# Altium schematic sheet DDRmem.SchDoc
size A; SheetNumber: 3; SheetTotal: 5
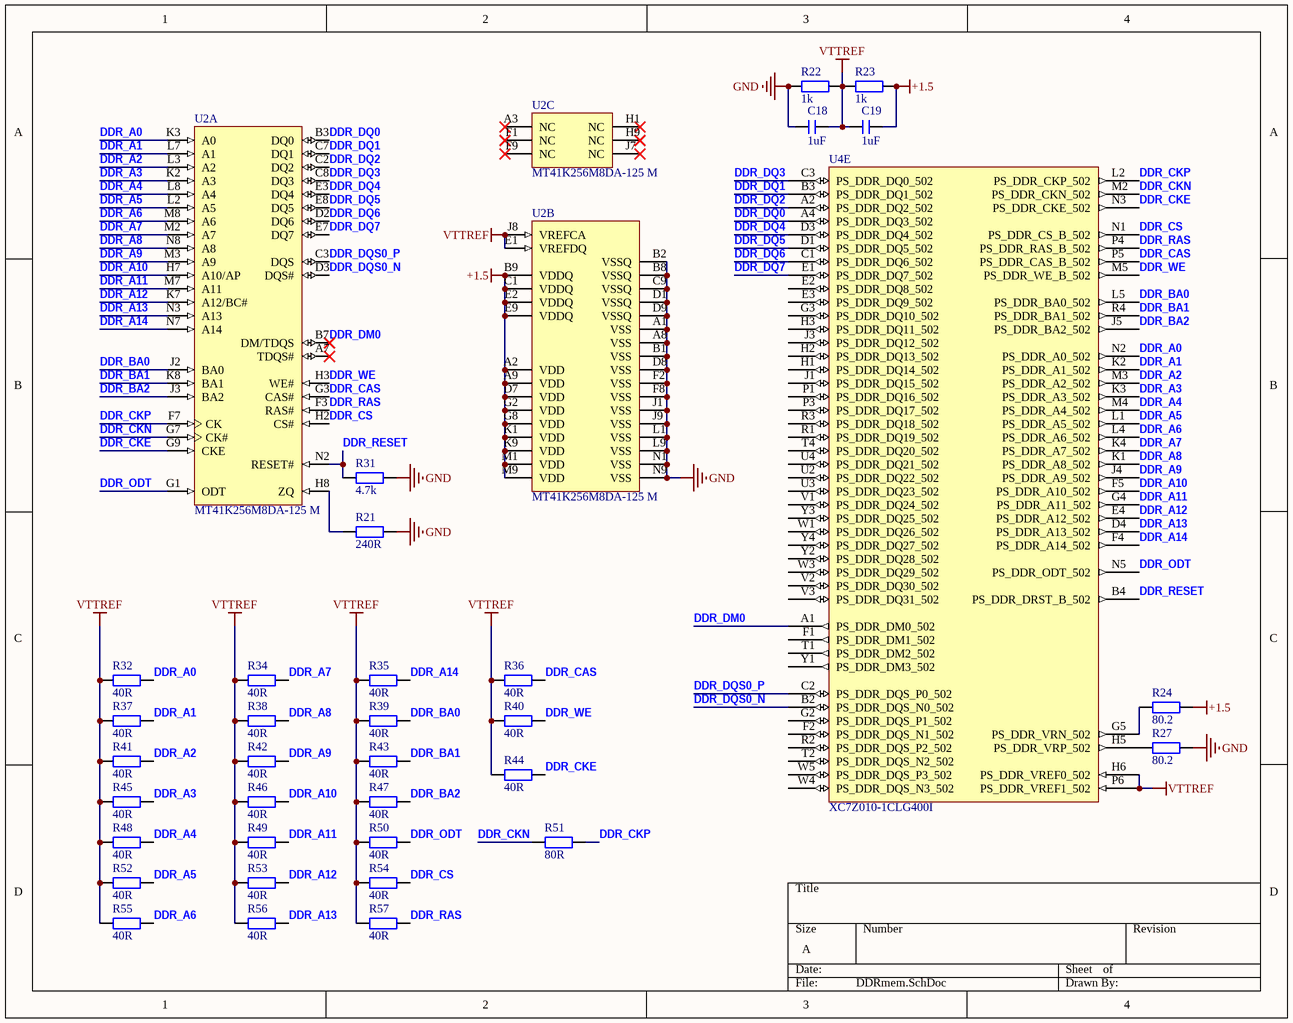
[diagram p0: DDRmem.SchDoc]

## Parts
C18  1uF  [CAP_0201]
C19  1uF  [CAP_0201]
R21  240R  [RES_0201]
R22  1k  [RES_0201]
R23  1k  [RES_0201]
R24  80.2  [RES_0201]
R27  80.2  [RES_0201]
R31  4.7k  [RES_0402]
R32  40R  [RES_0201]
R34  40R  [RES_0201]
R35  40R  [RES_0201]
R36  40R  [RES_0201]
R37  40R  [RES_0201]
R38  40R  [RES_0201]
R39  40R  [RES_0201]
R40  40R  [RES_0201]
R41  40R  [RES_0201]
R42  40R  [RES_0201]
R43  40R  [RES_0201]
R44  40R  [RES_0201]
R45  40R  [RES_0201]
R46  40R  [RES_0201]
R47  40R  [RES_0201]
R48  40R  [RES_0201]
R49  40R  [RES_0201]
R50  40R  [RES_0201]
R51  80R  [RES_0201]
R52  40R  [RES_0201]
R53  40R  [RES_0201]
R54  40R  [RES_0201]
R55  40R  [RES_0201]
R56  40R  [RES_0201]
R57  40R  [RES_0201]
U2  MT41K256M8DA-125 M  [MICT-DA-78]  (parts A,B,C of 3)
U4  XC7Z010-1CLG400I  [CLG400]  (part E of 9)

## Nets
+1.5: C19.1 R23.1 R24.1 U2.A2(VDD) U2.A9(VDD) U2.B9(VDDQ) U2.C1(VDDQ) U2.D7(VDD) U2.E2(VDDQ) U2.E9(VDDQ) U2.G2(VDD) U2.G8(VDD) U2.K1(VDD) U2.K9(VDD) U2.M1(VDD) U2.M9(VDD)
GND: C18.2 R21.1 R22.2 R27.1 R31.1 U2.A1(VSS) U2.A8(VSS) U2.B1(VSS) U2.B2(VSSQ) U2.B8(VSSQ) U2.C9(VSSQ) U2.D1(VSSQ) U2.D8(VSS) U2.D9(VSSQ) U2.F2(VSS) U2.F8(VSS) U2.J1(VSS) U2.J9(VSS) U2.L1(VSS) U2.L9(VSS) U2.N1(VSS) U2.N9(VSS)
VTTREF: C18.1 C19.2 R22.1 R23.2 R32.2 R34.2 R35.2 R36.2 R37.2 R38.2 R39.2 R40.2 R41.2 R42.2 R43.2 R44.2 R45.2 R46.2 R47.2 R48.2 R49.2 R50.2 R52.2 R53.2 R54.2 R55.2 R56.2 R57.2 U2.E1(VREFDQ) U2.J8(VREFCA) U4.H6(PS_DDR_VREF0_502) U4.P6(PS_DDR_VREF1_502)
DDR_A0: R32.1 U2.K3(A0) U4.N2(PS_DDR_A0_502)
DDR_A1: R37.1 U2.L7(A1) U4.K2(PS_DDR_A1_502)
DDR_A2: R41.1 U2.L3(A2) U4.M3(PS_DDR_A2_502)
DDR_A3: R45.1 U2.K2(A3) U4.K3(PS_DDR_A3_502)
DDR_A4: R48.1 U2.L8(A4) U4.M4(PS_DDR_A4_502)
DDR_A5: R52.1 U2.L2(A5) U4.L1(PS_DDR_A5_502)
DDR_A6: R55.1 U2.M8(A6) U4.L4(PS_DDR_A6_502)
DDR_A7: R34.1 U2.M2(A7) U4.K4(PS_DDR_A7_502)
DDR_A8: R38.1 U2.N8(A8) U4.K1(PS_DDR_A8_502)
DDR_A9: R42.1 U2.M3(A9) U4.J4(PS_DDR_A9_502)
DDR_A10: R46.1 U2.H7(A10/AP) U4.F5(PS_DDR_A10_502)
DDR_A11: R49.1 U2.M7(A11) U4.G4(PS_DDR_A11_502)
DDR_A12: R53.1 U2.K7(A12/BC#) U4.E4(PS_DDR_A12_502)
DDR_A13: R56.1 U2.N3(A13) U4.D4(PS_DDR_A13_502)
DDR_A14: R35.1 U2.N7(A14) U4.F4(PS_DDR_A14_502)
DDR_BA0: R39.1 U2.J2(BA0) U4.L5(PS_DDR_BA0_502)
DDR_BA1: R43.1 U2.K8(BA1) U4.R4(PS_DDR_BA1_502)
DDR_BA2: R47.1 U2.J3(BA2) U4.J5(PS_DDR_BA2_502)
DDR_CAS: R36.1 U2.G3(CAS#) U4.P5(PS_DDR_CAS_B_502)
DDR_CKE: R44.1 U2.G9(CKE) U4.N3(PS_DDR_CKE_502)
DDR_CKN: R51.2 U2.G7(CK#) U4.M2(PS_DDR_CKN_502)
DDR_CKP: R51.1 U2.F7(CK) U4.L2(PS_DDR_CKP_502)
DDR_CS: R54.1 U2.H2(CS#) U4.N1(PS_DDR_CS_B_502)
DDR_DM0: U2.B7(DM/TDQS) U4.A1(PS_DDR_DM0_502)
DDR_DQ0: U2.B3(DQ0) U4.A4(PS_DDR_DQ3_502)
DDR_DQ1: U2.C7(DQ1) U4.B3(PS_DDR_DQ1_502)
DDR_DQ2: U2.C2(DQ2) U4.A2(PS_DDR_DQ2_502)
DDR_DQ3: U2.C8(DQ3) U4.C3(PS_DDR_DQ0_502)
DDR_DQ4: U2.E3(DQ4) U4.D3(PS_DDR_DQ4_502)
DDR_DQ5: U2.E8(DQ5) U4.D1(PS_DDR_DQ5_502)
DDR_DQ6: U2.D2(DQ6) U4.C1(PS_DDR_DQ6_502)
DDR_DQ7: U2.E7(DQ7) U4.E1(PS_DDR_DQ7_502)
DDR_DQS0_N: U2.D3(DQS#) U4.B2(PS_DDR_DQS_N0_502)
DDR_DQS0_P: U2.C3(DQS) U4.C2(PS_DDR_DQS_P0_502)
DDR_ODT: R50.1 U2.G1(ODT) U4.N5(PS_DDR_ODT_502)
DDR_RAS: R57.1 U2.F3(RAS#) U4.P4(PS_DDR_RAS_B_502)
DDR_RESET: R31.2 U2.N2(RESET#) U4.B4(PS_DDR_DRST_B_502)
DDR_WE: R40.1 U2.H3(WE#) U4.M5(PS_DDR_WE_B_502)
NetR21_2: R21.2 U2.H8(ZQ)
NetR24_2: R24.2 U4.G5(PS_DDR_VRN_502)
NetR27_2: R27.2 U4.H5(PS_DDR_VRP_502)

Not connected (* = marked no-connect by the designer): U2 A3(NC)* A7(TDQS#)* F1(NC)* F9(NC)* H1(NC)* H9(NC)* J7(NC)*; U4 E2(PS_DDR_DQ8_502) E3(PS_DDR_DQ9_502) F1(PS_DDR_DM1_502) F2(PS_DDR_DQS_N1_502) G2(PS_DDR_DQS_P1_502) G3(PS_DDR_DQ10_502) H1(PS_DDR_DQ14_502) H2(PS_DDR_DQ13_502) H3(PS_DDR_DQ11_502) J1(PS_DDR_DQ15_502) J3(PS_DDR_DQ12_502) P1(PS_DDR_DQ16_502) P3(PS_DDR_DQ17_502) R1(PS_DDR_DQ19_502) R2(PS_DDR_DQS_P2_502) R3(PS_DDR_DQ18_502) T1(PS_DDR_DM2_502) T2(PS_DDR_DQS_N2_502) T4(PS_DDR_DQ20_502) U2(PS_DDR_DQ22_502) U3(PS_DDR_DQ23_502) U4(PS_DDR_DQ21_502) V1(PS_DDR_DQ24_502) V2(PS_DDR_DQ30_502) V3(PS_DDR_DQ31_502) W1(PS_DDR_DQ26_502) W3(PS_DDR_DQ29_502) W4(PS_DDR_DQS_N3_502) W5(PS_DDR_DQS_P3_502) Y1(PS_DDR_DM3_502) Y2(PS_DDR_DQ28_502) Y3(PS_DDR_DQ25_502) Y4(PS_DDR_DQ27_502)

## Library data of the parts
C18 C19 = C: 无极性贴片电容; 版权归属: 源创客; BOM名称: 无极性贴片电容; 学习资源: www.ooocke.com
R21-R24 R27 R31 R32 R34-R57 = R: 贴片电阻; 版权归属: 源创客; BOM名称: 贴片电阻; 学习资源: www.ooocke.com
U2 = CMP-0355-00008-1: 2Gb DDR3-1600 SDRAM, 256Mb x 8, 1.25ns, 1.35V, 0 to 95 degC, 78-Ball FBGA; Manufacturer: Micron; Clock Rate: 800 MHzÂ; Op. Temp.: 0C to +95CÂ; CL: CL = 11Â; Density: 2GbÂ; Data Rate: DDR3-1600Â; Cycle Time: 1.25nsÂ; Voltage: 1.35VÂ; ComponentLink2URL: http://www.micron.com/~/media/Documents/Products/Data%20Sheet/DRAM/2Gb_1_35V_DDR3L-RS.pdf; Width: x8Â; ComponentLink1Description: Manufacturer URL; Mounting Technology: Surface Mount; Depth: 256MbÂ; ComponentLink2Description: Datasheet; ComponentLink1URL: http://www.micron.com/; Package: FBGAÂ; DatasheetVersion: Rev. D; PackageVersion: Rev.H,M,K; PackageReference: MICT-DA-78; PackageDescription: 78-Ball Fine-Pitch Ball Grid Array, 10.5 x 8 mm, Pitch 0.8 mm; Pin Count: 78-ballÂ; PartNumber: MT41K256M8DA-125 M; ComponentLink3URL: http://www.micron.com/~/media/Documents/Products/Data%20Sheet/DRAM/2Gb_1_35V_DDR3L.pdf; ComponentLink3Description: Package Specification
U4 = CMP-0363-00008-3: 667 MHz Zynq™-7000 AP SoC, 130 PS I/O, 100 FPGA I/O, 400-Ball BGA, Speed Grade 1, Industrial Grade, Pb-Free; Speed Grade: -1; LUTs: 17600; Extensible Block RAM (# 36Kb Blocks): 240 KB (60); Flip Flops: 35200; PartNumber: XC7Z010-1CLG400I; Mounting Technology: Surface Mount; ComponentLink5URL: http://www.xilinx.com/support/documentation/user_guides/ug865-Zynq-7000-Pkg-Pinout.pdf; ComponentLink3URL: http://www.xilinx.com/support/documentation/data_sheets/ds187-XC7Z010-XC7Z020-Data-Sheet.pdf; PackageVersion: Rev 1.1, 09/2012; ComponentLink2Description: Package Specification; ComponentLink4Description: Package File; ComponentLink2URL: http://www.xilinx.com/support/documentation/user_guides/ug865-Zynq-7000-Pkg-Pinout.pdf; ComponentLink3Description: DC and AC Switching Characteristics; ComponentLink6Description: PCB and Layout Guide; ComponentLink4URL: http://www.xilinx.com/support/packagefiles/z7packages/xc7z010clg400pkg.txt; ComponentLink1URL: http://www.xilinx.com/support/documentation/data_sheets/ds190-Zynq-7000-Overview.pdf; Generic Part Number: XC7Z010; PackageReference: CLG400; ComponentLink1Description: Datasheet; RoHS: Pb-Free; ComponentLink6URL: http://www.xilinx.com/support/documentation/user_guides/ug483_7Series_PCB.pdf; DatasheetVersion: v1.2; PackageDescription: Wire-Bond Chip-Scale BGA, Body 17 x 17 mm, 0.8 mm Pitch; ComponentLink5Description: Packaging and Pinout; Code_JEDEC: MO-275-MMAA-1